# Altium project SJ2096POE.PrjPcb (part 2 of 7)

## Sheet ETH_PCIE_PHY.SchDoc: =project_title
size Tabloid; CompanyName: Luxonis Holding; DrawnBy: BW / MB / SJ; Organization: Luxonis Holding; Address1: 1925 Harmony Park Drive; Address2: Westminster, CO; Address3: 80234; Address4: United States; DocumentNumber: D2098000; Revision: R1M0E1; SheetNumber: 7; SheetTotal: 12
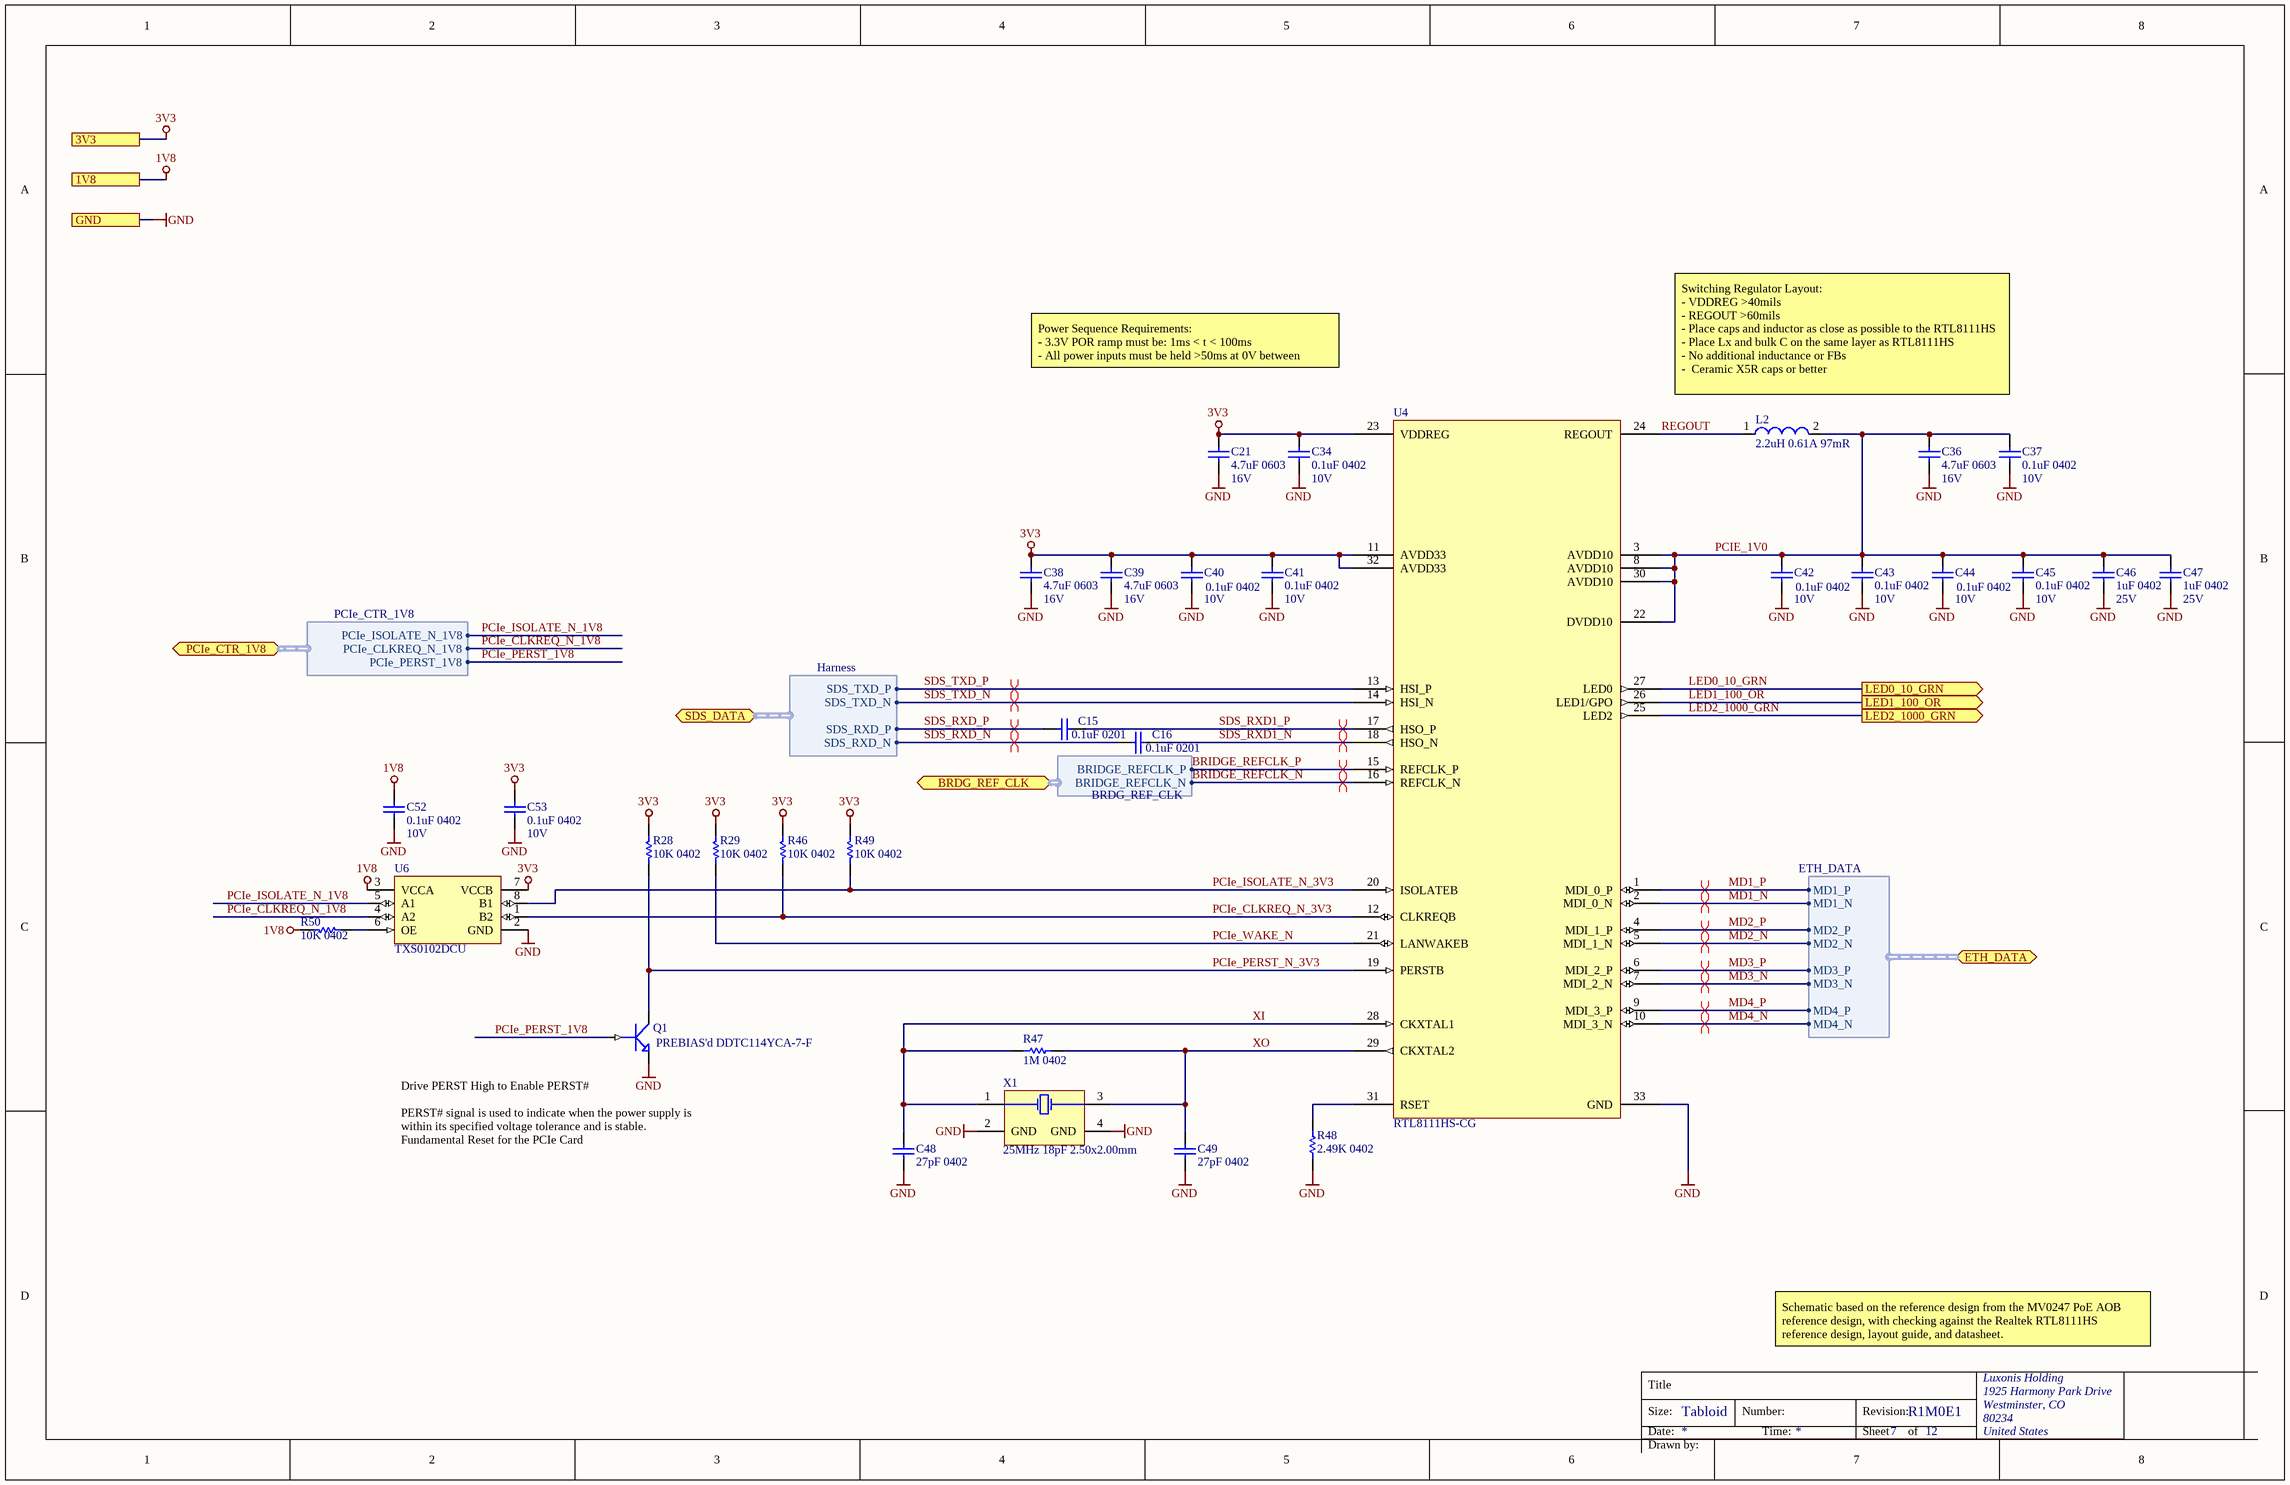
[diagram p4: ETH_PCIE_PHY.SchDoc]

### Parts
C15  0.1uF 0201  [CAPC0201(0603)33_L]
C16  0.1uF 0201  [CAPC0201(0603)33_L]
C21  4.7uF 0603  Voltage Rating: 16V  [CAPC0603(1608)100_N]
C34  0.1uF 0402  Voltage Rating: 10V  [CAPC0402(1005)70_N]
C36  4.7uF 0603  Voltage Rating: 16V  [CAPC0603(1608)100_N]
C37  0.1uF 0402  Voltage Rating: 10V  [CAPC0402(1005)70_N]
C38  4.7uF 0603  Voltage Rating: 16V  [CAPC0603(1608)100_N]
C39  4.7uF 0603  Voltage Rating: 16V  [CAPC0603(1608)100_N]
C40  0.1uF 0402  Voltage Rating: 10V  [CAPC0402(1005)70_N]
C41  0.1uF 0402  Voltage Rating: 10V  [CAPC0402(1005)70_N]
C42  0.1uF 0402  Voltage Rating: 10V  [CAPC0402(1005)70_N]
C43  0.1uF 0402  Voltage Rating: 10V  [CAPC0402(1005)70_N]
C44  0.1uF 0402  Voltage Rating: 10V  [CAPC0402(1005)70_N]
C45  0.1uF 0402  Voltage Rating: 10V  [CAPC0402(1005)70_N]
C46  1uF 0402  Voltage Rating: 25V  [CAPC0402(1005)70_N]
C47  1uF 0402  Voltage Rating: 25V  [CAPC0402(1005)70_N]
C48  27pF 0402  [CAPC0402(1005)60_N]
C49  27pF 0402  [CAPC0402(1005)60_N]
C52  0.1uF 0402  Voltage Rating: 10V  [CAPC0402(1005)70_N]
C53  0.1uF 0402  Voltage Rating: 10V  [CAPC0402(1005)70_N]
L2  2.2uH 0.61A 97mR  [LQH32NH2R2J23L]
Q1  PREBIAS'd DDTC114YCA-7-F  [DDTC114YCA-7-F]
R28  10K 0402  [RESC0402(1005)_N]
R29  10K 0402  [RESC0402(1005)_N]
R46  10K 0402  [RESC0402(1005)_N]
R47  1M 0402  [RESC0402(1005)_N]
R48  2.49K 0402  [RESC0402(1005)_N]
R49  10K 0402  [RESC0402(1005)_N]
R50  10K 0402  [RESC0402(1005)_N]
U4  RTL8111HS-CG  [RTL8111Hx-CG]
U6  TXS0102DCU  [TXS0102DCUR]
X1  25MHz 18pF 2.50x2.00mm  [ECS-250-18-36B-CKY-TR]

### Ports
1V8, 3V3, BRDG_REF_CLK (bidir, harness BRDG_REF_CLK), ETH_DATA (bidir, harness ETH_DATA), GND, LED0_10_GRN (out), LED1_100_OR (out), LED2_1000_GRN (out), PCIe_CTR_1V8 (bidir, harness PCIe_CTR_1V8), SDS_DATA (bidir, harness Harness)

### Harnesses
ETH_DATA: MD1_P, MD1_N, MD2_P, MD2_N, MD3_P, MD3_N, MD4_P, MD4_N
Harness: SDS_TXD_P, SDS_TXD_N, SDS_RXD_P, SDS_RXD_N
BRDG_REF_CLK: BRIDGE_REFCLK_P, BRIDGE_REFCLK_N
PCIe_CTR_1V8: PCIe_CLKREQ_N_1V8, PCIe_ISOLATE_N_1V8, PCIe_PERST_1V8

### Nets
1V8: C52.2 R50.2 U6.3(VCCA) ; port 1V8
3V3: C21.2 C34.2 C38.2 C39.2 C40.2 C41.2 C53.2 R28.1 R29.1 R46.1 R49.1 U4.11(AVDD33) U4.23(VDDREG) U4.32(AVDD33) U6.7(VCCB) ; port 3V3
GND: C21.1 C34.1 C36.1 C37.1 C38.1 C39.1 C40.1 C41.1 C42.1 C43.1 C44.1 C45.1 C46.1 C47.1 C48.1 C49.1 C52.1 C53.1 Q1.2(E) R48.1 U4.33(GND) U6.2(GND) X1.2(GND) X1.4(GND) ; port GND
BRIDGE_REFCLK_N: U4.16(REFCLK_N) ; port BRDG_REF_CLK.BRIDGE_REFCLK_N
BRIDGE_REFCLK_P: U4.15(REFCLK_P) ; port BRDG_REF_CLK.BRIDGE_REFCLK_P
LED0_10_GRN: U4.27(LED0) ; port LED0_10_GRN
LED1_100_OR: U4.26(LED1/GPO) ; port LED1_100_OR
LED2_1000_GRN: U4.25(LED2) ; port LED2_1000_GRN
MD1_N: U4.2(MDI_0_N) ; port ETH_DATA.MD1_N
MD1_P: U4.1(MDI_0_P) ; port ETH_DATA.MD1_P
MD2_N: U4.5(MDI_1_N) ; port ETH_DATA.MD2_N
MD2_P: U4.4(MDI_1_P) ; port ETH_DATA.MD2_P
MD3_N: U4.7(MDI_2_N) ; port ETH_DATA.MD3_N
MD3_P: U4.6(MDI_2_P) ; port ETH_DATA.MD3_P
MD4_N: U4.10(MDI_3_N) ; port ETH_DATA.MD4_N
MD4_P: U4.9(MDI_3_P) ; port ETH_DATA.MD4_P
PCIE_1V0: C36.2 C37.2 C42.2 C43.2 C44.2 C45.2 C46.2 C47.2 L2.2 U4.3(AVDD10) U4.8(AVDD10) U4.22(DVDD10) U4.30(AVDD10)
PCIe_CLKREQ_N_1V8: U6.4(A2) ; port PCIe_CTR_1V8.PCIe_CLKREQ_N_1V8
PCIe_CLKREQ_N_3V3: R46.2 U4.12(CLKREQB) U6.1(B2)
PCIe_ISOLATE_N_1V8: U6.5(A1) ; port PCIe_CTR_1V8.PCIe_ISOLATE_N_1V8
PCIe_ISOLATE_N_3V3: R49.2 U4.20(ISOLATEB) U6.8(B1)
PCIe_PERST_1V8: Q1.1(B) ; port PCIe_CTR_1V8.PCIe_PERST_1V8
PCIe_PERST_N_3V3: Q1.3(C) R28.2 U4.19(PERSTB)
PCIe_WAKE_N: R29.2 U4.21(LANWAKEB)
REGOUT: L2.1 U4.24(REGOUT)
SDS_RXD1_N: C16.2 U4.18(HSO_N)
SDS_RXD1_P: C15.2 U4.17(HSO_P)
SDS_RXD_N: C16.1 ; port SDS_DATA.SDS_RXD_N
SDS_RXD_P: C15.1 ; port SDS_DATA.SDS_RXD_P
SDS_TXD_N: U4.14(HSI_N) ; port SDS_DATA.SDS_TXD_N
SDS_TXD_P: U4.13(HSI_P) ; port SDS_DATA.SDS_TXD_P
XI: C48.2 R47.1 U4.28(CKXTAL1) X1.1(X1)
XO: C49.2 R47.2 U4.29(CKXTAL2) X1.3(X2)
NetR48_2: R48.2 U4.31(RSET)
NetR50_1: R50.1 U6.6(OE)

### Layout directives
differential pair; net class ETH; differential pair class 100ohm: MD1_N, MD1_P, MD2_N, MD2_P, MD3_N, MD3_P, MD4_N, MD4_P
differential pair; differential pair class 100ohm: BRIDGE_REFCLK_N, BRIDGE_REFCLK_P, SDS_RXD1_N, SDS_RXD1_P, SDS_RXD_N, SDS_RXD_P, SDS_TXD_N, SDS_TXD_P

### Notes on the sheet
- Power Sequence Requirements:
  - 3.3V POR ramp must be: 1ms < t < 100ms
  - All power inputs must be held >50ms at 0V between power cycles.
- Switching Regulator Layout:
  - VDDREG >40mils
  - REGOUT >60mils
  - Place caps and inductor as close as possible to the RTL8111HS
  - Place Lx and bulk C on the same layer as RTL8111HS
  - No additional inductance or FBs
  -  Ceramic X5R caps or better
- (near Q1) Drive PERST High to Enable PERST#
- PERST# signal is used to indicate when the power supply is within its specified voltage tolerance and is stable.
  Fundamental Reset for the PCIe Card
- Schematic based on the reference design from the MV0247 PoE AOB reference design, with checking against the Realtek RTL8111HS reference design, layout guide, and datasheet.
- Title
- Size:
- Date:
- Tabloid
- Number:
- Time:
- Revision:
- Sheet
- of
- Drawn by:

### Library data of the parts
C15 C16 = GRM033R61A104KE15D: CAP CER 0.1UF 10V X5R 0201; Manufacturer 1: Murata; Capacitance: 100nF; Tolerance: 10%; Supplier 1: Digi-Key; Manufacturer Part Number 1: GRM033R61A104KE15D; Stock 1: 45335312; Pricing 1: 1=0.10000, 10=0.04200, 100=0.01860, 500=0.01330, 1000=0.01045, 2500=0.00950, 5000=0.00874 (USD); RoHS: Yes; Mount: Surface Mount; Case/Package: 0201; Weight: 6E-06oz; Case Code (Metric): 0603; Case Code (Imperial): 0201; Min Operating Temperature: -55°C; Max Operating Temperature: 85°C; Packaging: Tape and Reel; Voltage Rating: 10V; Package Quantity: 1; Voltage Rating (DC): 10V; Dielectric: X5R; Termination: SMD/SMT; Length: 0.6mm; Height: 0.3mm; Width: 0.012inch; Thickness: 0.013inch; Depth: 0.3mm; Radiation Hardening: No; Lead Free: Lead Free; REACH SVHC: No SVHC; ComponentLink1URL: https://datasheet.ciiva.com/26843/getdatasheetpartid-308656-26843739.pdf?src-supplier=Verical; ComponentLink1Description: https://datasheet.ciiva.com/26843/getdatasheetpartid-308656-26843739.pdf?src-supplier=Verical; ComponentLink2URL: https://datasheet.ciiva.com/5413/product-5413117.pdf?src-supplier=Mouser; ComponentLink2Description: https://datasheet.ciiva.com/5413/product-5413117.pdf?src-supplier=Mouser; ComponentLink3URL: https://datasheet.ciiva.com/6256/partnumbering-e-01-6256406.pdf?src-supplier=Digi-Key; ComponentLink3Description: https://datasheet.ciiva.com/6256/partnumbering-e-01-6256406.pdf?src-supplier=Digi-Key; ComponentLink4URL: https://datasheet.ciiva.com/6256/partnumbering-e-01-6256407.pdf?src-supplier=Digi-Key; ComponentLink4Description: https://datasheet.ciiva.com/6256/partnumbering-e-01-6256407.pdf?src-supplier=Digi-Key; ComponentLink5URL: https://datasheet.ciiva.com/6256/partnumbering-e-01-6256408.pdf?src-supplier=Digi-Key; ComponentLink5Description: https://datasheet.ciiva.com/6256/partnumbering-e-01-6256408.pdf?src-supplier=Digi-Key; Supplier Part Number 1: 490-5881-1-ND; Voltage: 10V
C21 C36 C38 C39 = GRM188R61C475KAAJD: CAP CER 4.7UF 16V X5R 0603 10%; Manufacturer 1: Murata; Material: Ceramic; Supplier 1: Digi-Key; Manufacturer Part Number 1: GRM188R61C475KAAJD; Stock 1: 455058; Pricing 1: 1=0.35000, 10=0.24600, 100=0.14730, 500=0.11050, 1000=0.09331 (USD); RoHS: Yes; Mount: Surface Mount; Case/Package: 0603; Weight: 0.000222oz; Case Code (Metric): 1608; Case Code (Imperial): 0603; Min Operating Temperature: -55°C; Max Operating Temperature: 85°C; Capacitance: 4.7uF; Tolerance: 10%; Packaging: Tape and Reel; Dielectric: X5R; Termination: SMD/SMT; Voltage Rating (DC): 16V; Package Quantity: 4000; Length: 1.6mm; Height: 0.8mm; Width: 0.8mm; Thickness: 0.037inch; Depth: 0.8mm; REACH SVHC: No SVHC; Lead Free: Lead Free; ComponentLink1URL: https://datasheet.ciiva.com/14813/595grm188r61c475kaaj23-14813668.pdf?src-supplier=Arrow; ComponentLink1Description: https://datasheet.ciiva.com/14813/595grm188r61c475kaaj23-14813668.pdf?src-supplier=Arrow; Supplier 2: Digi-Key; Manufacturer 2: Murata; Manufacturer Part Number 2: GRM188R61C475KAAJD; Stock 2: 455058; Pricing 2: 1=0.35000, 10=0.24600, 100=0.14730, 500=0.11050, 1000=0.09331 (USD); Supplier 3: Digi-Key; Manufacturer 3: Murata; Manufacturer Part Number 3: GRM188R61C475KAAJD; Stock 3: 452000; Pricing 3: 4000=0.07259, 8000=0.06832, 12000=0.06619, 28000=0.06405 (USD); Supplier Part Number 1: 490-10481-1-ND; Supplier Part Number 2: 490-10481-6-ND; Supplier Part Number 3: 490-10481-2-ND
C34 C37 C40-C45 C52 C53 = GRM155R71A104JA01D: CAP CER 0.1UF 10V X7R 0402 5%; Manufacturer 1: Murata; Capacitance: 100nF; Supplier 1: Digi-Key; Manufacturer Part Number 1: GRM155R71A104JA01D; Stock 1: 1346709; Pricing 1: 1=0.10000, 10=0.02500, 100=0.01130, 500=0.00806, 1000=0.00633, 2500=0.00575, 5000=0.00529 (USD); RoHS: Yes; Mount: Surface Mount; Case/Package: 0402; Case Code (Imperial): 0402; Case Code (Metric): 1005; Min Operating Temperature: -55°C; Max Operating Temperature: 125°C; Tolerance: 5%; Packaging: Tape and Reel; Voltage Rating (DC): 10V; Dielectric: X7R; Package Quantity: 10000; Termination: SMD/SMT; Length: 1mm; Height: 0.5mm; Width: 0.02inch; Thickness: 0.022inch; Depth: 0.5mm; Radiation Hardening: No; Lead Free: Lead Free; ComponentLink1URL: https://datasheet.ciiva.com/5411/product-5411135.pdf?src-supplier=Mouser; ComponentLink1Description: https://datasheet.ciiva.com/5411/product-5411135.pdf?src-supplier=Mouser; ComponentLink2URL: https://datasheet.ciiva.com/11618/c02e-11618821.pdf?src-supplier=Avnet; ComponentLink2Description: https://datasheet.ciiva.com/11618/c02e-11618821.pdf?src-supplier=Avnet; Supplier Part Number 1: 490-10777-1-ND
C46 C47 = GRM155R61E105KA12D: CAP CER 1UF 25V X5R 0402 10%; Manufacturer 1: Murata; Material: Ceramic; Supplier 1: Digi-Key; Manufacturer Part Number 1: GRM155R61E105KA12D; Stock 1: 200653; Pricing 1: 1=0.10000, 10=0.07100, 100=0.03350, 500=0.02352, 1000=0.01947, 2500=0.01812, 5000=0.01658 (USD); RoHS: Yes; Mount: Surface Mount; Case/Package: 0402; Weight: 0.000212oz; Case Code (Metric): 1005; Case Code (Imperial): 0402; Min Operating Temperature: -55°C; Max Operating Temperature: 85°C; Tolerance: 10%; Capacitance: 1uF; Dielectric: X5R; Voltage Rating (DC): 25V; Packaging: Tape and Reel; Package Quantity: 10000; Termination: SMD/SMT; Voltage: 25V; Length: 1mm; Height: 0.5mm; Width: 0.5mm; Thickness: 0.022inch; Depth: 0.5mm; Lead Free: Lead Free; REACH SVHC: No SVHC; ComponentLink1URL: https://datasheet.ciiva.com/22732/1666664-22732122.pdf?src-supplier=Element14; ComponentLink1Description: https://datasheet.ciiva.com/22732/1666664-22732122.pdf?src-supplier=Element14; ComponentLink2URL: https://datasheet.ciiva.com/7719/1666664-7719006.pdf?src-supplier=Element14; ComponentLink2Description: https://datasheet.ciiva.com/7719/1666664-7719006.pdf?src-supplier=Element14; Supplier Part Number 1: 490-10017-1-ND; Supplier 2: Arrow; Supplier 3: TTI; Supplier Part Number 2: GRM155R61E105KA12D; Supplier Part Number 3: GRM155R61E105KA12D
C48 C49 = C0402C270J5GACTU: CAP CER 27PF 50V C0G/NP0 0402; Manufacturer 1: KEMET; Dielectric Material: Ceramic; Tolerance: 5%; Dielectric: C0G; Temperature Coefficient: 30ppm/°C; Supplier 1: Digi-Key; Manufacturer Part Number 1: C0402C270J5GACTU; RoHS: Yes; Category: Ceramic Capacitors; Stock 1: 1799770; Pricing 1: 1=0.10000, 10=0.03500, 100=0.01580, 500=0.01128, 1000=0.00886, 2500=0.00805, 5000=0.00741 (USD); Mount: Surface Mount,PCB; Case/Package: 0402; Number of Pins: 2; Weight: 2.3E-05oz; Case Code (Metric): 1005; Case Code (Imperial): 0402; Contact Plating: Tin,Matte; Min Operating Temperature: -55°C; Max Operating Temperature: 125°C; Capacitance: 27pF; Packaging: Tape and Reel; Voltage Rating (DC): 50V; Package Quantity: 1; Termination: SMD/SMT; Voltage Rating: 50V; Voltage: 50V; Length: 1mm; Height: 0.5mm; Width: 0.5mm; Depth: 0.5mm; Thickness: 0.022inch; Radiation Hardening: No; Lead Free: Lead Free; REACH SVHC: No SVHC; ComponentLink1URL: https://datasheet.ciiva.com/144/docfinderpartnumber-c0402c270j5gactu-144118.pdf?src-supplier=Digi-Key; ComponentLink1Description: https://datasheet.ciiva.com/144/docfinderpartnumber-c0402c270j5gactu-144118.pdf?src-supplier=Digi-Key; ComponentLink2URL: https://datasheet.ciiva.com/7747/kem-c1003-c0g-smd-7747509.pdf?src-supplier=Element14; ComponentLink2Description: https://datasheet.ciiva.com/7747/kem-c1003-c0g-smd-7747509.pdf?src-supplier=Element14; ComponentLink3URL: https://datasheet.ciiva.com/26847/getdatasheetpartid-408632-26847386.pdf?src-supplier=Verical; ComponentLink3Description: https://datasheet.ciiva.com/26847/getdatasheetpartid-408632-26847386.pdf?src-supplier=Verical; ComponentLink4URL: https://datasheet.ciiva.com/7392/1372242-7392237.pdf?src-supplier=Newark; ComponentLink4Description: https://datasheet.ciiva.com/7392/1372242-7392237.pdf?src-supplier=Newark; ComponentLink5URL: https://datasheet.ciiva.com/14586/70095383-14586671.pdf?src-supplier=Allied+Electronics; ComponentLink5Description: https://datasheet.ciiva.com/14586/70095383-14586671.pdf?src-supplier=Allied+Electronics; Supplier 2: Newark; Supplier 3: Mouser; Supplier Part Number 1: 399-1016-1-ND; Supplier Part Number 2: 53M7161; Supplier Part Number 3: 80-C0402C270J5G
L2 = LQH32NH2R2J23L: FIXED IND 2.2UH 610MA 97MOHM SMD; Manufacturer 1: Murata; Core Material: Ferrite; Tolerance: 5%; Shielding: Unshielded; Self Resonant Frequency: 75MHz; Test Frequency: 1MHz; Supplier 1: Digi-Key; Manufacturer Part Number 1: LQH32NH2R2J23L; RoHS: No; Stock 1: 1873; Pricing 1: 1=0.42000, 10=0.37400, 100=0.25740, 500=0.21998, 1000=0.16850 (USD); Mount: Surface Mount; Case/Package: Nonstandard; Min Operating Temperature: -40°C; Max Operating Temperature: 125°C; Composition: Wirewound; Packaging: Tape and Reel; Inductance: 2.2uH; Current Rating: 610mA; DC Resistance (DCR): 97mR; Ratings: AEC-Q200; ComponentLink1URL: http://search.murata.co.jp/Ceramy/image/img/P02/JELF243A-9146.pdf?src-supplier=Digi-Key; ComponentLink1Description: http://search.murata.co.jp/Ceramy/image/img/P02/JELF243A-9146.pdf?src-supplier=Digi-Key; Supplier 2: Mouser; Supplier 3: Arrow; Supplier Part Number 1: 490-17367-1-ND; Supplier Part Number 3: LQH32NH2R2J23L; Supplier Part Number 2: 81-LQH32NH2R2J23L
Q1 = DDTC114YCA-7-F: TRANS PREBIAS NPN 200MW SOT23-3; Manufacturer 1: Diodes; Element Configuration: Single; Collector Emitter Voltage (VCEO): 50V; Current Rating: 100mA; hFE Min: 68; Transition Frequency: 250MHz; Supplier 1: Digi-Key; Manufacturer Part Number 1: DDTC114YCA-7-F; RoHS: Yes; Category: BJTs; Stock 1: 18465; Pricing 1: 1=0.22000, 10=0.17900, 100=0.07320, 500=0.06106, 1000=0.04243 (USD); Mount: Surface Mount; Case/Package: SOT-23-3; Number of Pins: 3; Weight: 0.000282oz; Min Operating Temperature: -55°C; Max Operating Temperature: 150°C; Voltage Rating (DC): 50V; Package Quantity: 3000; Packaging: Tape and Reel; Max Power Dissipation: 200mW; Max Output Current: 100mA; Operating Supply Voltage: 50V; Max Collector Current: 100mA; Collector Emitter Breakdown Voltage: 50V; Max Breakdown Voltage: 50V; Polarity: NPN; Continuous Collector Current: 100mA; Length: 3.05mm; Height: 1mm; Width: 1.4mm; Radiation Hardening: No; Lead Free: Lead Free; ComponentLink1URL: https://datasheet.ciiva.com/16615/ds30330-16615737.pdf?src-supplier=Avnet+Europe; ComponentLink1Description: https://datasheet.ciiva.com/16615/ds30330-16615737.pdf?src-supplier=Avnet+Europe; Supplier 2: Mouser; Supplier 3: Arrow; Supplier Part Number 1: DDTC114YCA-FDICT-ND; Supplier Part Number 2: 621-DDTC114YCA-F; Supplier Part Number 3: DDTC114YCA-7-F
R28 R29 R46 R49 R50 = RC0402FR-1310KL: RES SMD 10K OHM 1% 0402 1/16W Chip Resistor, 0402 [1005 Metric], 10 kohm, RC Series, 50 V, Thick Film, 62.5 mW; Manufacturer 1: Yageo; Resistance: 10kR; Temperature Coefficient: 100ppm/°C; Power Rating: 62.5mW; Voltage Rating: 50V; ComponentLink1URL: https://datasheet.ciiva.com/16940/pyu-rc0402-51-rohs-l-6-16940293.pdf?src-supplier=Avnet+Europe; ComponentLink1Description: https://datasheet.ciiva.com/16940/pyu-rc0402-51-rohs-l-6-16940293.pdf?src-supplier=Avnet+Europe; ComponentLink2URL: https://datasheet.ciiva.com/28386/pyu-rc0402-51-rohs-l-6-28386855.pdf?src-supplier=Avnet+Europe; ComponentLink2Description: https://datasheet.ciiva.com/28386/pyu-rc0402-51-rohs-l-6-28386855.pdf?src-supplier=Avnet+Europe; ComponentLink3URL: https://datasheet.ciiva.com/16740/pyu-rc0402-51-rohs-l-6-r-16740602.pdf?src-supplier=Future+Electronics; ComponentLink3Description: https://datasheet.ciiva.com/16740/pyu-rc0402-51-rohs-l-6-r-16740602.pdf?src-supplier=Future+Electronics; ComponentLink4URL: https://datasheet.ciiva.com/8891/pyu-rc0402-51-rohs-l-6-8891339.pdf?src-supplier=Avnet; ComponentLink4Description: https://datasheet.ciiva.com/8891/pyu-rc0402-51-rohs-l-6-8891339.pdf?src-supplier=Avnet; ComponentLink5URL: https://datasheet.ciiva.com/5557/pyu-rc0402-51-rohs-l-6-r-5557997.pdf?src-supplier=Mouser; ComponentLink5Description: https://datasheet.ciiva.com/5557/pyu-rc0402-51-rohs-l-6-r-5557997.pdf?src-supplier=Mouser; ComponentLink6URL: https://datasheet.ciiva.com/7983/1018594-7983533.pdf?src-supplier=Element14; ComponentLink6Description: https://datasheet.ciiva.com/7983/1018594-7983533.pdf?src-supplier=Element14; Supplier 1: Newark; Manufacturer Part Number 1: RC0402FR-1310KL; Stock 1: 62239; Pricing 1: 1=0.10000, 25=0.01200, 100=0.00400, 250=0.00400, 500=0.00300, 1000=0.00300 (USD); RoHS: Yes; Case/Package: 0402; Number of Pins: 2; Contact Plating: Tin,Matte,Lead; Case Code (Imperial): 0402; Case Code (Metric): 1005; Min Operating Temperature: -55°C; Max Operating Temperature: 155°C; Tolerance: 1%; Composition: Thick Film; Packaging: Tape and Reel; Termination: SMD/SMT; Military Standard: Not; Voltage Rating (DC): 50V; Working Voltage: 50V; Number of Terminations: 2; Length: 1mm; Depth: 0.5mm; Radiation Hardening: No; REACH SVHC: No SVHC; Lead Free: Lead Free; Supplier Part Number 1: 67R9960; Supplier 2: Future Electronics; Supplier 3: Mouser; Supplier 4: Element14; Supplier Part Number 2: RC0402FR-1310KL-CUTT; Supplier Part Number 3: 603-RC0402FR-1310KL; Supplier Part Number 4: 1799235
R47 = RC0402FR-071ML: RES SMD 1M OHM 1% 1/16W 0402; Manufacturer 1: Yageo; Resistance: 1MR; Temperature Coefficient: 100ppm/°C; Power Rating: 63mW; Voltage Rating: 50V; Manufacturer Part Number 1: RC0402FR-071ML; Supplier 1: Digi-Key; Stock 1: 11406681; Pricing 1: 1=0.10000, 10=0.01500, 100=0.00600, 1000=0.00268, 2500=0.00232, 5000=0.00192 (USD); RoHS: Yes; Case/Package: 0402; Case Code (Imperial): 0402; Case Code (Metric): 1005; Min Operating Temperature: -55°C; Max Operating Temperature: 155°C; Packaging: Tape and Reel; Tolerance: 1%; Composition: Thick Film; Military Standard: Not; Termination: SMD/SMT; Length: 1mm; Height: 0.32mm; Depth: 0.5mm; Lead Free: Lead Free; REACH SVHC: Unknown; ComponentLink1URL: https://datasheet.ciiva.com/11808/0900766b80c66297-11808125.pdf?src-supplier=RSComponents; ComponentLink1Description: https://datasheet.ciiva.com/11808/0900766b80c66297-11808125.pdf?src-supplier=RSComponents; ComponentLink2URL: https://datasheet.ciiva.com/46394/1018594-46394951.pdf?src-supplier=Element14; ComponentLink2Description: https://datasheet.ciiva.com/46394/1018594-46394951.pdf?src-supplier=Element14; ComponentLink3URL: https://datasheet.ciiva.com/16741/pyu-rc0402-51-rohs-l-6-r-16741081.pdf?src-supplier=Future+Electronics; ComponentLink3Description: https://datasheet.ciiva.com/16741/pyu-rc0402-51-rohs-l-6-r-16741081.pdf?src-supplier=Future+Electronics; ComponentLink4URL: https://datasheet.ciiva.com/7849/1018594-7849882.pdf?src-supplier=Element14; ComponentLink4Description: https://datasheet.ciiva.com/7849/1018594-7849882.pdf?src-supplier=Element14; ComponentLink5URL: https://datasheet.ciiva.com/7849/1018594-7849883.pdf?src-supplier=Element14; ComponentLink5Description: https://datasheet.ciiva.com/7849/1018594-7849883.pdf?src-supplier=Element14; Supplier Part Number 1: 311-1.00MLRCT-ND; Supplier 2: Mouser; Supplier Part Number 2: 603-RC0402FR-071ML
R48 = RC0402FR-072K49L: RES SMD 2.49K OHM 1% 1/16W 0402; Manufacturer 1: Yageo; Resistance: 2.49kR; Temperature Coefficient: 100ppm/°C; Power Rating: 62.5mW; Voltage Rating: 50V; Max Power Dissipation: 63mW; Supplier 1: Digi-Key; Manufacturer Part Number 1: RC0402FR-072K49L; RoHS: Yes; Category: Chip SMD Resistors; Stock 1: 1962352; Pricing 1: 1=0.10000, 10=0.01600, 100=0.00640, 1000=0.00289, 2500=0.00251, 5000=0.00207 (USD); Case/Package: 0402; Case Code (Metric): 1005; Case Code (Imperial): 0402; Contact Plating: Tin,Lead,Matte; Min Operating Temperature: -55°C; Max Operating Temperature: 155°C; Tolerance: 1%; Packaging: Tape and Reel; Composition: Thick Film; Package Quantity: 1; Termination: SMD/SMT; Number of Terminations: 2; Voltage Rating (DC): 50V; Features: Moisture Resistant; Military Standard: Not; Length: 0.039inch; Height: 0.016inch; Width: 0.02inch; Depth: 0.5mm; Radiation Hardening: No; Lead Free: Lead Free; REACH SVHC: No SVHC; ComponentLink1URL: https://datasheet.ciiva.com/2518/pyu-r-int-thick-7-2518985.pdf?src-supplier=Digi-Key; ComponentLink1Description: https://datasheet.ciiva.com/2518/pyu-r-int-thick-7-2518985.pdf?src-supplier=Digi-Key; ComponentLink2URL: https://datasheet.ciiva.com/2518/pyu-r-int-thick-7-2518986.pdf?src-supplier=Digi-Key; ComponentLink2Description: https://datasheet.ciiva.com/2518/pyu-r-int-thick-7-2518986.pdf?src-supplier=Digi-Key; ComponentLink3URL: https://datasheet.ciiva.com/5558/pyu-rc0402-51-rohs-l-6-r-5558122.pdf?src-supplier=Mouser; ComponentLink3Description: https://datasheet.ciiva.com/5558/pyu-rc0402-51-rohs-l-6-r-5558122.pdf?src-supplier=Mouser; ComponentLink4URL: https://datasheet.ciiva.com/16868/pyu-rc0402-51-rohs-l-6-16868954.pdf?src-supplier=Avnet+Europe; ComponentLink4Description: https://datasheet.ciiva.com/16868/pyu-rc0402-51-rohs-l-6-16868954.pdf?src-supplier=Avnet+Europe; ComponentLink5URL: https://datasheet.ciiva.com/2518/pyu-r-int-thick-7-2518987.pdf?src-supplier=Digi-Key; ComponentLink5Description: https://datasheet.ciiva.com/2518/pyu-r-int-thick-7-2518987.pdf?src-supplier=Digi-Key; ComponentLink6URL: https://datasheet.ciiva.com/7983/1018594-7983516.pdf?src-supplier=Element14; ComponentLink6Description: https://datasheet.ciiva.com/7983/1018594-7983516.pdf?src-supplier=Element14; ComponentLink7URL: https://datasheet.ciiva.com/28414/pyu-rc0402-51-rohs-l-6-28414366.pdf?src-supplier=Avnet+Europe; ComponentLink7Description: https://datasheet.ciiva.com/28414/pyu-rc0402-51-rohs-l-6-28414366.pdf?src-supplier=Avnet+Europe; Supplier 2: Mouser; Supplier 3: Newark; Supplier Part Number 3: 67R9905; Supplier Part Number 1: 311-2.49KLRCT-ND; Supplier Part Number 2: 603-RC0402FR-072K49L
U4 = RTL8111HS: IC ETHERNET/PCIe PHY Realtek; Manufacturer 1: Realtek; Manufacturer Part Number 1: RTL8111HS-CG; Supplier 1: Symmetry Electronics; Supplier Part Number 1: RTL8111HS-CG; Supplier 2: Future Electronics; Supplier Part Number 2: RTL8111HS-CG
U6 = TXS0102DCUR: TEXAS INSTRUMENTS - TXS0102DCUR - IC, TRANSLATOR, 2 BIT, BI, US-8; Min Supply Voltage: 1.65V; Max Supply Voltage: 5.5V; Data Rate: 24Mbps; Number of Channels: 2; Propagation Delay: 4.6ns; Turn-On Delay Time: 260ns; High Level Output Current: -20uA; Low Level Output Current: 1mA; Quiescent Current: 14.4uA; Output Type: Voltage; Output Current: 1A; Supplier 1: Digi-Key; Manufacturer 1: Texas Instruments; Manufacturer Part Number 1: TXS0102DCUR; RoHS: Yes; Category: Logic Gates; Stock 1: 55123; Pricing 1: 1=0.75000, 10=0.65900, 25=0.61960, 100=0.50550, 250=0.46956, 500=0.39964, 1000=0.31971 (USD); Case/Package: VSSOP; Number of Pins: 8; Weight: 0.000339oz; Min Operating Temperature: -40°C; Max Operating Temperature: 85°C; Package Quantity: 1; Packaging: Tape and Reel; Logic Function: Translator; Number of Bits: 2; Number of Inputs: 2; Nominal Supply Current: 14.4uA; Radiation Hardening: No; Lead Free: Lead Free; REACH SVHC: No SVHC; ComponentLink1URL: https://datasheet.ciiva.com/15096/getdatasheetpartid-118249-15096172.pdf?src-supplier=Verical; ComponentLink1Description: https://datasheet.ciiva.com/15096/getdatasheetpartid-118249-15096172.pdf?src-supplier=Verical; ComponentLink2URL: https://datasheet.ciiva.com/22653/1846850-22653373.pdf?src-supplier=Farnell; ComponentLink2Description: https://datasheet.ciiva.com/22653/1846850-22653373.pdf?src-supplier=Farnell; ComponentLink3URL: https://datasheet.ciiva.com/1508/1857232-1508821.pdf?src-supplier=Element14; ComponentLink3Description: https://datasheet.ciiva.com/1508/1857232-1508821.pdf?src-supplier=Element14; ComponentLink4URL: https://datasheet.ciiva.com/1899/txs0102-1899368.pdf?src-supplier=Digi-Key; ComponentLink4Description: https://datasheet.ciiva.com/1899/txs0102-1899368.pdf?src-supplier=Digi-Key; ComponentLink5URL: https://datasheet.ciiva.com/1899/txs0102-1899369.pdf?src-supplier=Digi-Key; ComponentLink5Description: https://datasheet.ciiva.com/1899/txs0102-1899369.pdf?src-supplier=Digi-Key; ComponentLink6URL: https://datasheet.ciiva.com/1899/txs0102-1899370.pdf?src-supplier=Digi-Key; ComponentLink6Description: https://datasheet.ciiva.com/1899/txs0102-1899370.pdf?src-supplier=Digi-Key; ComponentLink7URL: https://datasheet.ciiva.com/14287/txs0102-14287516.pdf?src-supplier=Avnet; ComponentLink7Description: https://datasheet.ciiva.com/14287/txs0102-14287516.pdf?src-supplier=Avnet; ComponentLink8URL: https://datasheet.ciiva.com/28499/1863639-28499676.pdf?src-supplier=Element14; ComponentLink8Description: https://datasheet.ciiva.com/28499/1863639-28499676.pdf?src-supplier=Element14; ComponentLink9URL: https://datasheet.ciiva.com/14287/txs0102-14287518.pdf?src-supplier=Avnet; ComponentLink9Description: https://datasheet.ciiva.com/14287/txs0102-14287518.pdf?src-supplier=Avnet; ComponentLink10URL: https://datasheet.ciiva.com/46395/1863639-46395871.pdf?src-supplier=Element14; ComponentLink10Description: https://datasheet.ciiva.com/46395/1863639-46395871.pdf?src-supplier=Element14; Supplier 2: Newark; Supplier 3: Mouser; Supplier Part Number 1: 296-21931-1-ND; Supplier Part Number 2: 30M1878; Supplier Part Number 3: 595-TXS0102DCUR
X1 = ECS-250-18-36B-CKY-TR: CRYSTAL 25.0000MHZ 18PF SMD 25MHz ±10ppm Crystal 18pF 50 Ohms 4-SMD, No Lead; Manufacturer 1: ECS International; Supplier 1: Digi-Key; Manufacturer Part Number 1: ECS-250-18-36B-CKY-TR; RoHS: No; Stock 1: 1111; Pricing 1: 1=0.48000, 10=0.39900, 50=0.35880, 100=0.31900, 500=0.30306 (USD); Supplier 2: Mouser; Supplier 3: Arrow; Supplier Part Number 1: XC3051CT-ND; Supplier Part Number 2: 520-250-18-36B-CKYT; Supplier Part Number 3: ECS-250-18-36B-CKY-TR

## Sheet RJ45.SchDoc: =project_title
size Tabloid; CompanyName: Luxonis Holding; DrawnBy: BW / MB / SJ; Organization: Luxonis Holding; Address1: 1925 Harmony Park Drive; Address2: Westminster, CO; Address3: 80234; Address4: United States; DocumentNumber: D2098000; Revision: R1M0E1; SheetNumber: 8; SheetTotal: 12
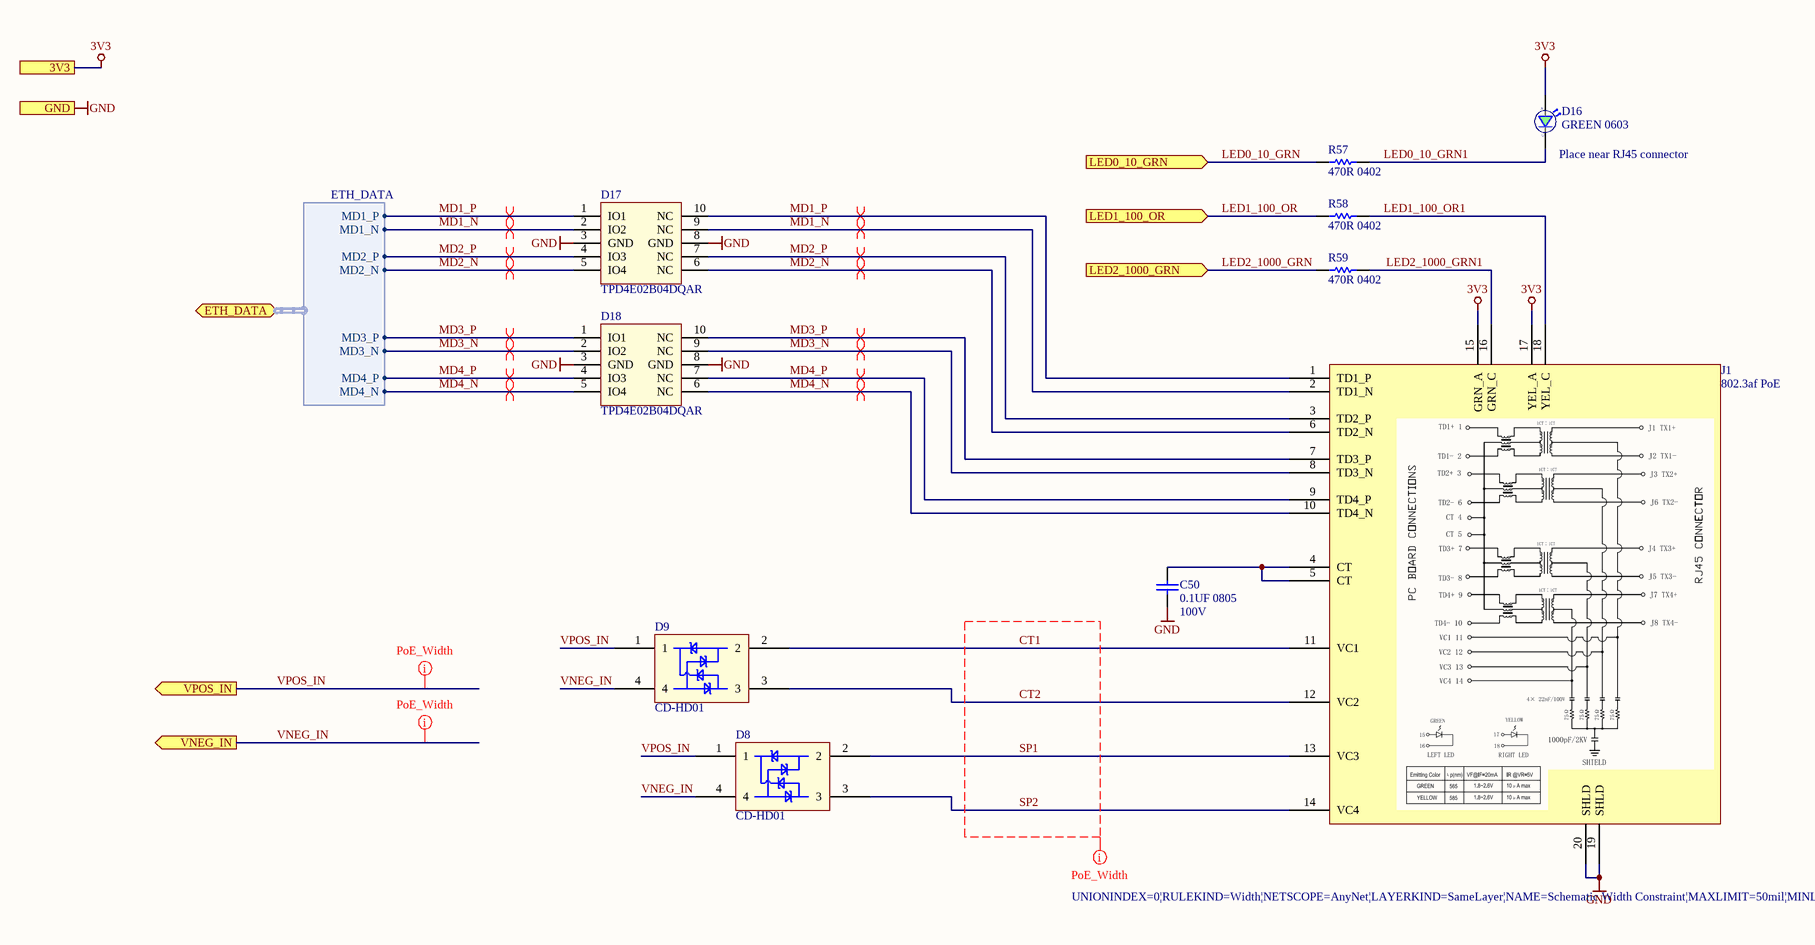
[diagram p5: RJ45.SchDoc]

### Parts
C50  0.1UF 0805  Voltage Rating: 100V  [CAPC0805(2012)145_N]
D8  CD-HD01  [CD-H01]
D9  CD-HD01  [CD-H01]
D16  GREEN 0603  [SML_D1xx8W]
D17  TPD4E02B04DQAR  [TPD4E02B04DQAR]
D18  TPD4E02B04DQAR  [TPD4E02B04DQAR]
J1  802.3af PoE  [TRJG0926HENL]
R57  470R 0402  [RESC0402(1005)_N]
R58  470R 0402  [RESC0402(1005)_N]
R59  470R 0402  [RESC0402(1005)_N]

### Ports
3V3, ETH_DATA (bidir, harness ETH_DATA), GND, LED0_10_GRN (in), LED1_100_OR (in), LED2_1000_GRN (in), VNEG_IN (out), VPOS_IN (out)

### Harnesses
ETH_DATA: MD1_P, MD1_N, MD2_P, MD2_N, MD3_P, MD3_N, MD4_P, MD4_N

### Nets
3V3: D16.2(A) J1.15(GRN_A) J1.17(YEL_A) ; port 3V3
GND: C50.1 D17.3(GND) D17.8(GND) D18.3(GND) D18.8(GND) J1.19(SHLD) J1.20(SHLD) ; port GND
VNEG_IN: D8.4 D9.4 ; port VNEG_IN
CT1: D9.2 J1.11(VC1)
CT2: D9.3 J1.12(VC2)
LED0_10_GRN: R57.1 ; port LED0_10_GRN
LED0_10_GRN1: D16.1(C) R57.2
LED1_100_OR: R58.1 ; port LED1_100_OR
LED1_100_OR1: J1.18(YEL_C) R58.2
LED2_1000_GRN: R59.1 ; port LED2_1000_GRN
LED2_1000_GRN1: J1.16(GRN_C) R59.2
MD1_N: D17.2(IO2) D17.9(NC) J1.2(TD1_N) ; port ETH_DATA.MD1_N
MD1_P: D17.1(IO1) D17.10(NC) J1.1(TD1_P) ; port ETH_DATA.MD1_P
MD2_N: D17.5(IO4) D17.6(NC) J1.6(TD2_N) ; port ETH_DATA.MD2_N
MD2_P: D17.4(IO3) D17.7(NC) J1.3(TD2_P) ; port ETH_DATA.MD2_P
MD3_N: D18.2(IO2) D18.9(NC) J1.8(TD3_N) ; port ETH_DATA.MD3_N
MD3_P: D18.1(IO1) D18.10(NC) J1.7(TD3_P) ; port ETH_DATA.MD3_P
MD4_N: D18.5(IO4) D18.6(NC) J1.10(TD4_N) ; port ETH_DATA.MD4_N
MD4_P: D18.4(IO3) D18.7(NC) J1.9(TD4_P) ; port ETH_DATA.MD4_P
SP1: D8.2 J1.13(VC3)
SP2: D8.3 J1.14(VC4)
VPOS_IN: D8.1 D9.1 ; port VPOS_IN
NetC50_2: C50.2 J1.4(CT) J1.5(CT)

### Layout directives
differential pair; net class ETH; differential pair class 100ohm: MD1_N, MD1_P, MD2_N, MD2_P, MD3_N, MD3_P, MD4_N, MD4_P
rule Width Constraint [Pref Width = 15mil    Min Width = 4mil    Max Width = 50mil]; net class PoE: CT1, CT2, SP1, SP2, VNEG_IN, VPOS_IN

### Notes on the sheet
- (near D16) Place near RJ45 connector
- Title
- Size:
- Date:
- Tabloid
- Number:
- Time:
- Revision:
- Sheet
- of
- Drawn by:

### Library data of the parts
C50 = CL21B104KCFNNNE: CAP CER 0.1UF 100V X7R 0805; Manufacturer 1: Samsung; Tolerance: 10%; Capacitance: 100nF; Supplier 1: Digi-Key; Manufacturer Part Number 1: CL21B104KCFNNNE; Stock 1: 93036; Pricing 1: 1=0.10000, 10=0.06800, 100=0.03050, 500=0.02180, 1000=0.01712 (USD); RoHS: Yes; Mount: Surface Mount; Case/Package: 0805; Case Code (Metric): 2012; Case Code (Imperial): 0805; Min Operating Temperature: -55°C; Max Operating Temperature: 125°C; Packaging: Tape and Reel; Dielectric: X7R; Length: 2mm; Width: 0.049inch; Thickness: 0.053inch; Depth: 1.25mm; Radiation Hardening: No; ComponentLink1URL: https://datasheet.ciiva.com/26936/getdatasheetpartid-781823-26936904.pdf?src-supplier=Verical; ComponentLink1Description: https://datasheet.ciiva.com/26936/getdatasheetpartid-781823-26936904.pdf?src-supplier=Verical; Supplier 2: Newark; Supplier 3: Future Electronics; Supplier Part Number 3: CL21B104KCFNNNE-CUTT; Supplier Part Number 2: 82AC9430; Supplier Part Number 1: 1276-6840-1-ND
D8 D9 = CD-HD01: CD-HD0x Series Schottky Bridge Rectifier Diode 100V 4-Pin Surface Mount T/R; Manufacturer: Bourns; Average Rectified Current: 1A; Supplier 1: Digi-Key; Manufacturer Part Number: CD-HD01; RoHS: No; Stock 1: 15383; Pricing 1: 1=0.61000, 10=0.52500, 100=0.36400, 500=0.28420, 1000=0.23100, 2000=0.21700 (USD); Mount: Surface Mount; Min Operating Temperature: -55°C; Max Operating Temperature: 125°C; Packaging: Tape and Reel; ComponentLink1URL: http://www.farnell.com/datasheets/2176057.pdf?src-supplier=Farnell; ComponentLink1Description: http://www.farnell.com/datasheets/2176057.pdf?src-supplier=Farnell; ComponentLink2URL: https://www.bourns.com/docs/Product-Datasheets/cd-hd0x.pdf?src-supplier=Digi-Key; ComponentLink2Description: https://www.bourns.com/docs/Product-Datasheets/cd-hd0x.pdf?src-supplier=Digi-Key; Supplier Part Number 1: CD-HD01CT-ND; Manufacturer 1: Bourns; Manufacturer Part Number 1: CD-HD01
D16 = SML-D12M8WT86: LED GREEN DIFFUSED 0603 SMD Green 572nm LED Indication - Discrete 2.2V 0603 (1608 Metric); Manufacturer: Rohm; Colour: Green,Yellow; Lens Colour: White,Clear,Diffused; Lens Style: Diffused,Colorless,Rectangular; Forward Current: 20mA; Luminous Intensity: 25mcd; Number of LEDs: 1; Viewing Angle: 160°; Lens Color: White,Diffused; Mount: Surface Mount; Case/Package: 0603; Number of Pins: 2; Case Code (Metric): 1608; Case Code (Imperial): 0603; Min Operating Temperature: -40°C; Max Operating Temperature: 85°C; Forward Voltage: 2.2V; Packaging: Tape and Reel; Dominant Wavelength: 572nm; Wavelength: 572nm; Illumination Colour: Green; Package Quantity: 1; Test Current: 20mA; Lens Transparency: Diffused; Length: 1.6mm; Height: 0.65mm; Width: 0.8mm; Radiation Hardening: No; REACH SVHC: Unknown; Lead Free: Lead Free; ComponentLink1URL: https://datasheet.ciiva.com/11774/0900766b80df3ada-11774260.pdf; ComponentLink1Description: https://datasheet.ciiva.com/11774/0900766b80df3ada-11774260.pdf; ComponentLink2URL: https://datasheet.ciiva.com/3161/sml-d1-3161419.pdf; ComponentLink2Description: https://datasheet.ciiva.com/3161/sml-d1-3161419.pdf; ComponentLink3URL: https://datasheet.ciiva.com/2110/sml-d1-2110396.pdf; ComponentLink3Description: https://datasheet.ciiva.com/2110/sml-d1-2110396.pdf; ComponentLink4URL: https://datasheet.ciiva.com/2110/sml-d1-2110397.pdf; ComponentLink4Description: https://datasheet.ciiva.com/2110/sml-d1-2110397.pdf; ComponentLink5URL: https://datasheet.ciiva.com/2110/sml-d1-2110398.pdf; ComponentLink5Description: https://datasheet.ciiva.com/2110/sml-d1-2110398.pdf; Manufacturer Part Number: SML-D12M8WT86; Supplier 1: Digi-Key; Manufacturer 1: Rohm; Manufacturer Part Number 1: SML-D12M8WT86; Stock 1: 112971; Pricing 1: 1=0.33000, 10=0.23900, 100=0.11340, 500=0.07560, 1000=0.05922 (USD); RoHS: Yes; Color: Green,Yellow; Illumination Color: Green; ComponentLink6URL: https://datasheet.ciiva.com/11774/0900766b80df3ada-11774260.pdf?src-supplier=RSComponents; ComponentLink6Description: https://datasheet.ciiva.com/11774/0900766b80df3ada-11774260.pdf?src-supplier=RSComponents; ComponentLink7URL: https://datasheet.ciiva.com/3161/sml-d1-3161419.pdf?src-supplier=Avnet; ComponentLink7Description: https://datasheet.ciiva.com/3161/sml-d1-3161419.pdf?src-supplier=Avnet; ComponentLink8URL: https://datasheet.ciiva.com/2110/sml-d1-2110396.pdf?src-supplier=Digi-Key; ComponentLink8Description: https://datasheet.ciiva.com/2110/sml-d1-2110396.pdf?src-supplier=Digi-Key; ComponentLink9URL: https://datasheet.ciiva.com/2110/sml-d1-2110397.pdf?src-supplier=Digi-Key; ComponentLink9Description: https://datasheet.ciiva.com/2110/sml-d1-2110397.pdf?src-supplier=Digi-Key; ComponentLink10URL: https://datasheet.ciiva.com/2110/sml-d1-2110398.pdf?src-supplier=Digi-Key; ComponentLink10Description: https://datasheet.ciiva.com/2110/sml-d1-2110398.pdf?src-supplier=Digi-Key; Supplier Part Number 1: 511-1578-1-ND
D17 D18 = TPD4E02B04DQAR: TVS DIODE 3.6V 8.8V 10USON 8.8V (Typ) Clamp 5A (8/20µs) Ipp Tvs Diode Surface Mount 10-USON (2.5x1); Manufacturer 1: Texas Instruments; Number of Bidirectional Channels: 4; Min Breakdown Voltage: 5.5V; Peak Pulse Power: 17W; Power Line Protection: No; Interface: USB,HDMI; Supplier 1: Digi-Key; Manufacturer Part Number 1: TPD4E02B04DQAR; Stock 1: 25615; Pricing 1: 1=0.69000, 10=0.60800, 100=0.46650, 500=0.36874, 1000=0.29499 (USD); RoHS: Yes; Mount: Surface Mount; Number of Pins: 10; Min Operating Temperature: -40°C; Max Operating Temperature: 125°C; Packaging: Cut Tape; Reverse Standoff Voltage: 3.6V; Clamping Voltage: 8.8V; Operating Supply Voltage: 3.6V; Peak Pulse Current: 5A; Number of Channels: 4; Composition: Zener; REACH SVHC: No SVHC; Lead Free: Lead Free; ComponentLink1URL: http://www.ti.com/general/docs/lit/getliterature.tsp?genericPartNumber=TPD4E02B04&amp;&amp;fileType=pdf&src-supplier=Element14; ComponentLink1Description: http://www.ti.com/general/docs/lit/getliterature.tsp?genericPartNumber=TPD4E02B04&amp;&amp;fileType=pdf&src-supplier=Element14; ComponentLink2URL: http://www.ti.com/lit/ds/symlink/tpd4e02b04.pdf?src-supplier=Farnell; ComponentLink2Description: http://www.ti.com/lit/ds/symlink/tpd4e02b04.pdf?src-supplier=Farnell; ComponentLink3URL: http://www.ti.com/lit/ds/symlink/tpd4e02b04.pdf?src-supplier=Newark; ComponentLink3Description: http://www.ti.com/lit/ds/symlink/tpd4e02b04.pdf?src-supplier=Newark; ComponentLink4URL: http://www.ti.com/lit/ds/symlink/tpd4e02b04.pdf?src-supplier=Digi-Key; ComponentLink4Description: http://www.ti.com/lit/ds/symlink/tpd4e02b04.pdf?src-supplier=Digi-Key; Supplier Part Number 1: 296-43875-1-ND
J1 = TRJG0926HENL: CONN MAGJACK 1PORT 1000 BASET; Manufacturer 1: Trxcom; System: Connector; Manufacturer Part Number 1: TRJG0926HENL; Supplier 1: Trxcom; Supplier Part Number 1: TRJG0926HENL
R57-R59 = CRCW0402470RFKED: RES SMD 470 OHM 1% 1/16W 0402; Manufacturer 1: Vishay; Temperature Coefficient: 100ppm/°C; Power Rating: 63mW; Voltage Rating: 50V; Supplier 1: Digi-Key; Manufacturer Part Number 1: CRCW0402470RFKED; Stock 1: 9199; Pricing 1: 1=0.10000, 10=0.03800, 100=0.01540, 1000=0.00690, 2500=0.00599, 5000=0.00495 (USD); RoHS: Yes; Case/Package: 0402; Weight: 2.3E-05oz; Case Code (Imperial): 0402; Case Code (Metric): 1005; Min Operating Temperature: -55°C; Max Operating Temperature: 155°C; Packaging: Tape and Reel; Resistance: 470R; Tolerance: 1%; Composition: Thick Film; Voltage Rating (DC): 50V; Termination: SMD/SMT; Military Standard: Not; Length: 1mm; Height: 0.35mm; Width: 0.5mm; Depth: 0.5mm; Lead Free: Lead Free; ComponentLink1URL: https://datasheet.ciiva.com/11811/0900766b80d98824-11811416.pdf?src-supplier=RSComponents; ComponentLink1Description: https://datasheet.ciiva.com/11811/0900766b80d98824-11811416.pdf?src-supplier=RSComponents; Supplier 2: Newark; Supplier Part Number 1: 541-470LCT-ND; Supplier Part Number 2: 26W9133; Mount: Surface Mount; Contact Plating: Tin; Number of Terminations: 2; Package Quantity: 10; Max Power Dissipation: 63mW; Features: Automotive AEC-Q200; Radiation Hardening: No; REACH SVHC: Unknown; ComponentLink2URL: https://datasheet.ciiva.com/16764/70201119-16764886.pdf?src-supplier=Allied+Electronics; ComponentLink2Description: https://datasheet.ciiva.com/16764/70201119-16764886.pdf?src-supplier=Allied+Electronics; ComponentLink3URL: https://datasheet.ciiva.com/28613/1720486-28613479.pdf?src-supplier=Element14; ComponentLink3Description: https://datasheet.ciiva.com/28613/1720486-28613479.pdf?src-supplier=Element14; ComponentLink4URL: https://datasheet.ciiva.com/3256/dcrcwe3-3256553.pdf?src-supplier=Avnet; ComponentLink4Description: https://datasheet.ciiva.com/3256/dcrcwe3-3256553.pdf?src-supplier=Avnet; ComponentLink5URL: https://datasheet.ciiva.com/7777/1720486-7777243.pdf?src-supplier=Element14; ComponentLink5Description: https://datasheet.ciiva.com/7777/1720486-7777243.pdf?src-supplier=Element14; ComponentLink6URL: https://datasheet.ciiva.com/8336/dcrcwe3-8336715.pdf?src-supplier=Avnet; ComponentLink6Description: https://datasheet.ciiva.com/8336/dcrcwe3-8336715.pdf?src-supplier=Avnet; ComponentLink7URL: https://datasheet.ciiva.com/7777/1697337-7777244.pdf?src-supplier=Element14; ComponentLink7Description: https://datasheet.ciiva.com/7777/1697337-7777244.pdf?src-supplier=Element14; ComponentLink8URL: https://datasheet.ciiva.com/2463/dcrcwe3-2463085.pdf?src-supplier=Digi-Key; ComponentLink8Description: https://datasheet.ciiva.com/2463/dcrcwe3-2463085.pdf?src-supplier=Digi-Key; ComponentLink9URL: https://datasheet.ciiva.com/16362/dcrcwe3-16362109.pdf?src-supplier=Future+Electronics; ComponentLink9Description: https://datasheet.ciiva.com/16362/dcrcwe3-16362109.pdf?src-supplier=Future+Electronics; ComponentLink10URL: https://datasheet.ciiva.com/16882/dcrcwe3-16882493.pdf?src-supplier=Avnet+Europe; ComponentLink10Description: https://datasheet.ciiva.com/16882/dcrcwe3-16882493.pdf?src-supplier=Avnet+Europe; ComponentLink11URL: https://datasheet.ciiva.com/2463/dcrcwe3-2463086.pdf?src-supplier=Digi-Key; ComponentLink11Description: https://datasheet.ciiva.com/2463/dcrcwe3-2463086.pdf?src-supplier=Digi-Key; ComponentLink12URL: https://datasheet.ciiva.com/2463/dcrcwe3-2463087.pdf?src-supplier=Digi-Key; ComponentLink12Description: https://datasheet.ciiva.com/2463/dcrcwe3-2463087.pdf?src-supplier=Digi-Key